# Altium schematic sheet Sheet_1_2021-12-01.schdoc
size 263 x 188 mm
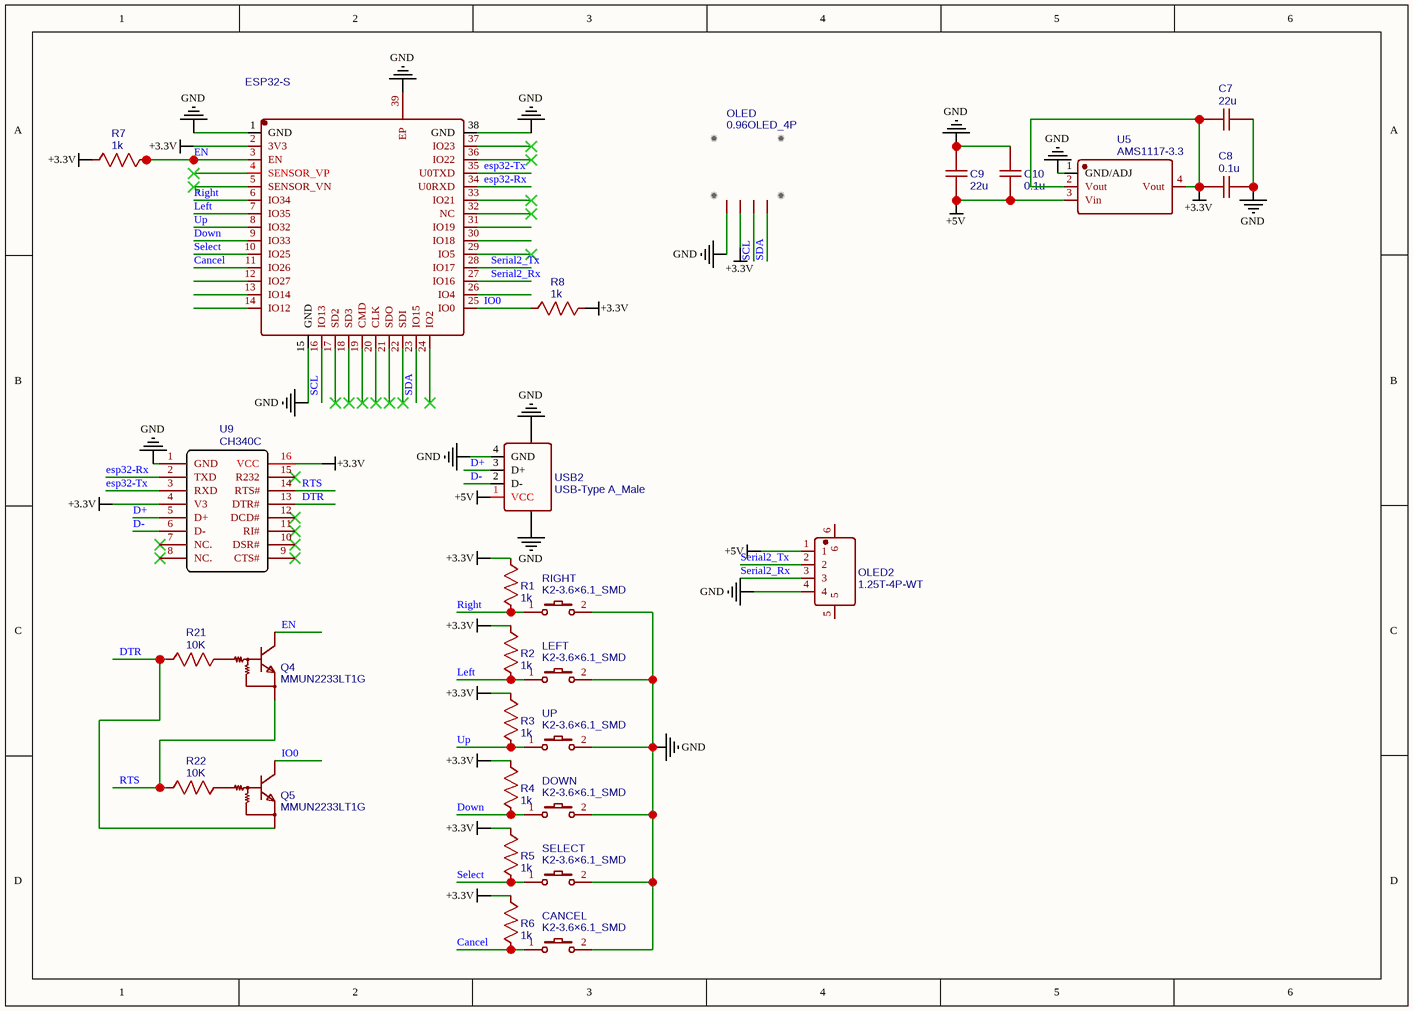
[diagram p0: Sheet_1_2021-12-01.schdoc]

## Parts
C7  22u  [C0603]
C8  0.1u  [C0603]
C9  22u  [C0603]
C10  0.1u  [C0603]
CANCEL  K2-3.6×6.1_SMD  [KEY-SMD_2P-L6.2-W3.6-LS8.0]
DOWN  K2-3.6×6.1_SMD  [KEY-SMD_2P-L6.2-W3.6-LS8.0]
ESP  ESP32-S  [WIRELM-SMD_ESP32-S]
LEFT  K2-3.6×6.1_SMD  [KEY-SMD_2P-L6.2-W3.6-LS8.0]
OLED  0.96OLED_4P  [0.96OLED_4P]
OLED2  1.25T-4P-WT  [CONN-SMD_4P-1.25P_1.25T-4P]
Q4  MMUN2233LT1G  [SOT-23-3_L2.9-W1.3-P1.90-LS2.4-BR]
Q5  MMUN2233LT1G  [SOT-23-3_L2.9-W1.3-P1.90-LS2.4-BR]
R1  1k  [R0603]
R2  1k  [R0603]
R3  1k  [R0603]
R4  1k  [R0603]
R5  1k  [R0603]
R6  1k  [R0603]
R7  1k  [R0603]
R8  1k  [R0603]
R21  10K  [R0603]
R22  10K  [R0603]
RIGHT  K2-3.6×6.1_SMD  [KEY-SMD_2P-L6.2-W3.6-LS8.0]
SELECT  K2-3.6×6.1_SMD  [KEY-SMD_2P-L6.2-W3.6-LS8.0]
U5  AMS1117-3.3  [SOT-223-3_L6.5-W3.4-P2.30-LS7.0-BR]
U9  CH340C  [SOP-16_L10.0-W3.9-P1.27-LS6.0-BL]
UP  K2-3.6×6.1_SMD  [KEY-SMD_2P-L6.2-W3.6-LS8.0]
USB2  USB-Type A_Male  [USB-A-TH_48037-0001]

## Nets
+3.3V: C7.1 C8.1 ESP.2(3V3) OLED.2 R1.2 R2.2 R3.2 R4.2 R5.2 R6.2 R7.2 R8.2 U5.2(Vout) U5.4(Vout) U9.4(V3) U9.16(VCC)
+5V: C9.1 C10.1 OLED2.1 U5.3(Vin) USB2.1(VCC)
GND: C7.2 C8.2 C9.2 C10.2 CANCEL.2 DOWN.2 ESP.1(GND) ESP.15(GND) ESP.38(GND) ESP.39(EP) LEFT.2 OLED.1 OLED2.4 RIGHT.2 SELECT.2 U5.1(GND/ADJ) U9.1(GND) UP.2 USB2.4(GND) USB2.5 USB2.6
Cancel: CANCEL.1 ESP.11(IO26) R6.1
D+: U9.5(D+) USB2.3(D+)
D-: U9.6(D-) USB2.2(D-)
Down: DOWN.1 ESP.9(IO33) R4.1
DTR: Q5.2(E) R21.1 U9.13(DTR#)
EN: ESP.3(EN) Q4.3(C) R7.1
esp32-Rx: ESP.34(U0RXD) U9.2(TXD)
esp32-Tx: ESP.35(U0TXD) U9.3(RXD)
IO0: ESP.25(IO0) Q5.3(C) R8.1
Left: ESP.7(IO35) LEFT.1 R2.1
Right: ESP.6(IO34) R1.1 RIGHT.1
RTS: Q4.2(E) R22.1 U9.14(RTS#)
SCL: ESP.16(IO13) OLED.3
SDA: ESP.23(IO15) OLED.4
Select: ESP.10(IO25) R5.1 SELECT.1
Serial2_Rx: ESP.27(IO16) OLED2.3
Serial2_Tx: ESP.28(IO17) OLED2.2
Up: ESP.8(IO32) R3.1 UP.1
NetQ4_1: Q4.1(B) R21.2
NetQ5_1: Q5.1(B) R22.2

Not connected (* = marked no-connect by the designer): ESP 4(SENSOR_VP)* 5(SENSOR_VN)* 12(IO27) 13(IO14) 14(IO12) 17(SD2)* 18(SD3)* 19(CMD)* 20(CLK)* 21(SDO)* 22(SDI)* 24(IO2)* 26(IO4) 29(IO5)* 30(IO18) 31(IO19) 32(NC)* 33(IO21)* 36(IO22)* 37(IO23)*; OLED2 5 6; U9 7(NC.)* 8(NC.)* 9(CTS#)* 10(DSR#)* 11(RI#)* 12(DCD#)* 15(R232)*

## Notes on the sheet
- (in symbol 0.96OLED_4P) Hello World!!!

## Library data of the parts
C7 C9 = 22u: nameAlias: Value(F); Contributor: LCEDA_Lib; spicePre: C; spiceSymbolName: C_0603_US
C8 C10 = 0.1u: nameAlias: Value(F); Contributor: LCEDA_Lib; spicePre: C; spiceSymbolName: C_0603_US
CANCEL DOWN LEFT RIGHT SELECT UP = K2-3.6×6.1_SMD: BOM_Manufacturer Part: K2-1107ST-A4SW-06; Contributor: LCEDA_Lib; 制造商: 韩国韩荣; BOM_Supplier Part: C118141; BOM_Supplier: LCSC; spicePre: K; spiceSymbolName: K2-3.6×6.1_SMD
ESP = ESP32-S: BOM_Manufacturer: Ai-Thinker; Contributor: LCSC; BOM_Supplier: LCSC; BOM_Supplier Part: C277944; BOM_Manufacturer Part: ESP32-S; BOM_JLCPCB Part Class: Extended Part; spicePre: U; spiceSymbolName: ESP32-S
OLED = 0.96OLED_4P: Contributor: LCEDA_Lib; BOM_Supplier: LCSC; spicePre: O; spiceSymbolName: 0.96OLED_4P
OLED2 = 1.25T-4P-WT: BOM_Manufacturer: HRO; Contributor: LCSC; BOM_Supplier: LCSC; BOM_Manufacturer Part: 1.25T-4P-WT; BOM_Supplier Part: C125739; BOM_JLCPCB Part Class: Extended Part; spicePre: C; spiceSymbolName: 1.25T-4P-WT
Q4 Q5 = MMUN2233LT1G: BOM_Manufacturer: ON; BOM_Supplier: LCSC; BOM_Manufacturer Part: MMUN2233LT1G; BOM_Supplier Part: C86932; BOM_JLCPCB Part Class: Extended Part; spicePre: Q; spiceSymbolName: MMUN2233LT1G
R1-R8 = 1k: nameAlias: Value(Ω); Contributor: LCEDA_Lib; spicePre: R; spiceSymbolName: R_0603_US
R21 R22 = 10K: nameAlias: Value(Ω); Contributor: LCEDA_Lib; spicePre: R; spiceSymbolName: R_0603_US
U5 = AMS1117-3.3: BOM_Manufacturer: AMS; sourceId: dwIGgezVh; timeStamp: 1476261164; BOM_Supplier: LCSC; BOM_Manufacturer Part: AMS1117-3.3; BOM_Supplier Part: C6186; BOM_JLCPCB Part Class: Basic Part; spicePre: U; spiceSymbolName: AMS1117-3.3
U9 = CH340C: BOM_Manufacturer: WCH; BOM_Supplier: LCSC; BOM_Manufacturer Part: CH340C; BOM_Supplier Part: C84681; BOM_JLCPCB Part Class: Extended Part; spicePre: U; spiceSymbolName: CH340C
USB2 = USB-Type A_Male: BOM_Manufacturer: SOFNG; BOM_Manufacturer Part: USB-05; Contributor: LCEDA_Lib; BOM_Supplier Part: C112454; BOM_Supplier: LCSC; spicePre: U; spiceSymbolName: USB-Type A_Male